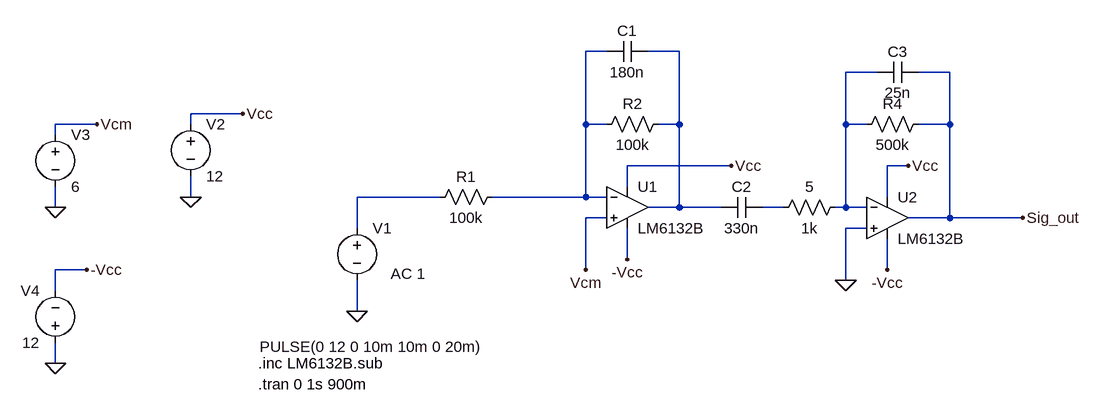
[diagram p0: schematic Sine Wave.asc]
Sine Wave.asc, the LTspice schematic file:
Version 4
SHEET 1 1052 680
WIRE 304 -80 272 -80
WIRE 416 -80 368 -80
WIRE 720 -48 672 -48
WIRE 832 -48 784 -48
WIRE -256 16 -336 16
WIRE -480 32 -544 32
WIRE -336 32 -336 16
WIRE 272 32 272 -80
WIRE 304 32 272 32
WIRE 416 32 416 -80
WIRE 416 32 384 32
WIRE 672 32 672 -48
WIRE 704 32 672 32
WIRE 832 32 832 -48
WIRE 832 32 784 32
WIRE -544 48 -544 32
WIRE 496 96 336 96
WIRE 768 96 736 96
WIRE 336 128 336 96
WIRE -336 144 -336 112
WIRE 48 144 -80 144
WIRE 272 144 272 32
WIRE 272 144 128 144
WIRE 304 144 272 144
WIRE 736 144 736 96
WIRE -544 160 -544 128
WIRE 416 160 416 32
WIRE 416 160 368 160
WIRE 480 160 416 160
WIRE 576 160 544 160
WIRE 672 160 672 32
WIRE 672 160 656 160
WIRE 704 160 672 160
WIRE 304 176 272 176
WIRE 832 176 832 32
WIRE 832 176 768 176
WIRE 944 176 832 176
WIRE -80 192 -80 144
WIRE 704 192 672 192
WIRE 336 240 336 192
WIRE -496 256 -544 256
WIRE 272 256 272 176
WIRE 736 256 736 208
WIRE 672 272 672 192
WIRE -544 288 -544 256
WIRE -80 320 -80 272
WIRE -544 400 -544 368
FLAG -80 320 0
FLAG -336 144 0
FLAG -256 16 Vcc
FLAG -544 160 0
FLAG -480 32 Vcm
FLAG 496 96 Vcc
FLAG 768 96 Vcc
FLAG 944 176 Sig_out
FLAG 672 272 0
FLAG -496 256 -Vcc
FLAG -544 400 0
FLAG 736 256 -Vcc
FLAG 272 256 Vcm
FLAG 336 240 -Vcc
SYMBOL voltage -80 176 R0
WINDOW 3 -150 198 Left 2
WINDOW 123 52 86 Left 2
WINDOW 39 0 0 Left 0
SYMATTR Value PULSE(0 12 0 10m 10m 0 20m)
SYMATTR Value2 AC 1
SYMATTR InstName V1
SYMBOL voltage -336 16 R0
WINDOW 123 0 0 Left 0
WINDOW 39 0 0 Left 0
SYMATTR InstName V2
SYMATTR Value 12
SYMBOL res 144 128 R90
WINDOW 0 0 56 VBottom 2
WINDOW 3 32 56 VTop 2
SYMATTR InstName R1
SYMATTR Value 100k
SYMBOL res 400 16 R90
WINDOW 0 0 56 VBottom 2
WINDOW 3 32 56 VTop 2
SYMATTR InstName R2
SYMATTR Value 100k
SYMBOL cap 368 -96 R90
WINDOW 0 0 32 VBottom 2
WINDOW 3 32 32 VTop 2
SYMATTR InstName C1
SYMATTR Value 180n
SYMBOL OpAmps\\opamp2 336 96 R0
SYMATTR InstName U1
SYMATTR Value LM6132B
SYMBOL voltage -544 32 R0
WINDOW 123 0 0 Left 0
WINDOW 39 0 0 Left 0
SYMATTR InstName V3
SYMATTR Value 6
SYMBOL OpAmps\\opamp2 736 112 R0
SYMATTR InstName U2
SYMATTR Value LM6132B
SYMBOL res 672 144 R90
WINDOW 0 0 56 VBottom 2
WINDOW 3 32 56 VTop 2
SYMATTR InstName 5
SYMATTR Value 1k
SYMBOL res 688 48 R270
WINDOW 0 32 56 VTop 2
WINDOW 3 0 56 VBottom 2
SYMATTR InstName R4
SYMATTR Value 500k
SYMBOL cap 784 -64 R90
WINDOW 0 0 32 VBottom 2
WINDOW 3 32 32 VTop 2
SYMATTR InstName C3
SYMATTR Value 25n
SYMBOL voltage -544 384 R180
WINDOW 0 24 96 Left 2
WINDOW 3 24 16 Left 2
WINDOW 123 0 0 Left 0
WINDOW 39 0 0 Left 0
SYMATTR InstName V4
SYMATTR Value 12
SYMBOL cap 544 144 R90
WINDOW 0 0 32 VBottom 2
WINDOW 3 32 32 VTop 2
SYMATTR InstName C2
SYMATTR Value 330n
TEXT -232 400 Left 2 !.inc LM6132B.sub
TEXT -232 432 Left 2 !.tran 0 1s 900m

The netlist it stands for:
* Sine Wave.asc
V1 N004 0 PULSE(0 12 0 10m 10m 0 20m) AC 1
V2 Vcc 0 12
R1 N001 N004 100k
R2 N002 N001 100k
C1 N002 N001 180n
XU1 Vcm N001 Vcc -Vcc N002 LM6132B  ; pins In+ In- V+ V- OUT
V3 Vcm 0 6
XU2 0 N003 Vcc -Vcc Sig_out LM6132B  ; pins In+ In- V+ V- OUT
R§5 N003 N005 1k
R4 N003 Sig_out 500k
C3 Sig_out N003 25n
V4 0 -Vcc 12
C2 N005 N002 330n
.inc LM6132B.sub
.tran 0 1s 900m
.backanno
.end